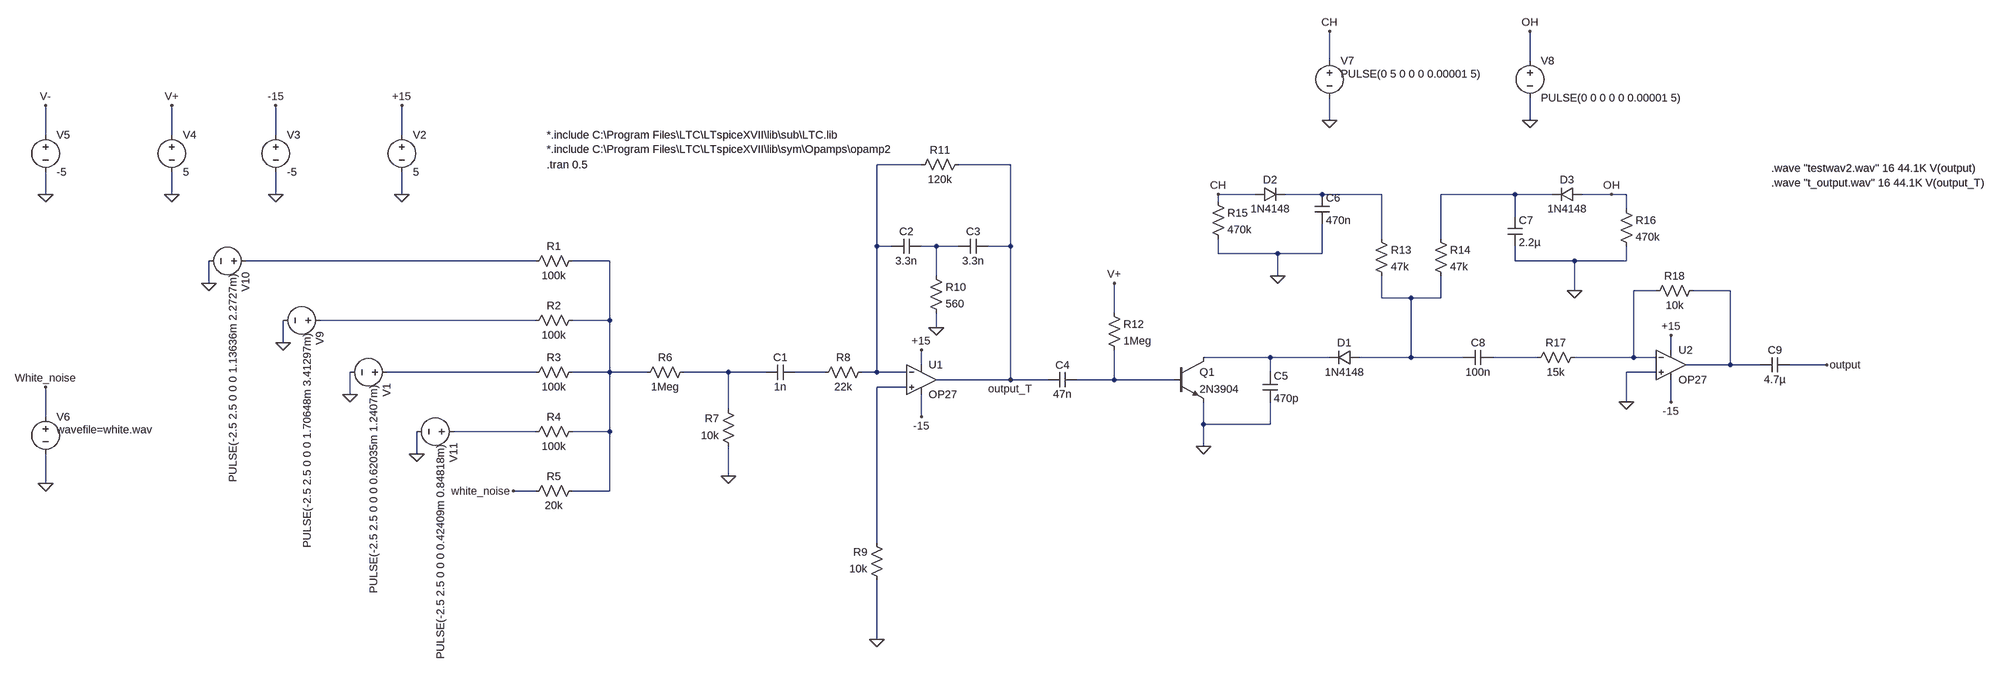
[diagram p0: schematic Cymbal - Mickey Delp.asc]
Cymbal - Mickey Delp.asc, the LTspice schematic file:
Version 4
SHEET 1 3932 968
WIRE 1760 -320 1760 -384
WIRE 2192 -320 2192 -384
WIRE 1760 -192 1760 -240
WIRE 2192 -192 2192 -240
WIRE -1008 -160 -1008 -224
WIRE -736 -160 -736 -224
WIRE -512 -160 -512 -224
WIRE -240 -160 -240 -224
WIRE 880 -96 784 -96
WIRE 1072 -96 960 -96
WIRE -1008 -32 -1008 -80
WIRE -736 -32 -736 -80
WIRE -512 -32 -512 -80
WIRE -240 -32 -240 -80
WIRE 1600 -32 1520 -32
WIRE 1744 -32 1664 -32
WIRE 1872 -32 1744 -32
WIRE 2160 -32 2000 -32
WIRE 2240 -32 2160 -32
WIRE 2368 -32 2304 -32
WIRE 2400 -32 2368 -32
WIRE 1520 -16 1520 -32
WIRE 2400 0 2400 -32
WIRE 2160 16 2160 -32
WIRE 1872 64 1872 -32
WIRE 2000 64 2000 -32
WIRE 784 80 784 -96
WIRE 816 80 784 80
WIRE 912 80 880 80
WIRE 960 80 912 80
WIRE 1072 80 1072 -96
WIRE 1072 80 1024 80
WIRE 1520 96 1520 64
WIRE 1648 96 1520 96
WIRE 1744 96 1744 32
WIRE 1744 96 1648 96
WIRE 48 112 -576 112
WIRE 208 112 128 112
WIRE 2160 112 2160 80
WIRE 2288 112 2160 112
WIRE 2400 112 2400 80
WIRE 2400 112 2288 112
WIRE 912 144 912 80
WIRE 1648 144 1648 96
WIRE -656 160 -656 112
WIRE 2288 176 2288 112
WIRE 2464 176 2416 176
WIRE 2624 176 2544 176
WIRE 1872 192 1872 144
WIRE 1936 192 1872 192
WIRE 2000 192 2000 144
WIRE 2000 192 1936 192
WIRE 1296 224 1296 160
WIRE 48 240 -416 240
WIRE 208 240 208 112
WIRE 208 240 128 240
WIRE 912 256 912 224
WIRE -496 288 -496 240
WIRE 2496 304 2496 272
WIRE 1632 320 1488 320
WIRE 1760 320 1632 320
WIRE 1936 320 1936 192
WIRE 1936 320 1824 320
WIRE 2048 320 1936 320
WIRE 2208 320 2112 320
WIRE 2416 320 2416 176
WIRE 2416 320 2288 320
WIRE 2464 320 2416 320
WIRE 880 336 880 304
WIRE 2624 336 2624 176
WIRE 2624 336 2528 336
WIRE 2688 336 2624 336
WIRE 2832 336 2752 336
WIRE 48 352 -272 352
WIRE 208 352 208 240
WIRE 208 352 128 352
WIRE 288 352 208 352
WIRE 464 352 368 352
WIRE 544 352 464 352
WIRE 672 352 608 352
WIRE 784 352 784 80
WIRE 784 352 752 352
WIRE 848 352 784 352
WIRE 1632 352 1632 320
WIRE 2464 352 2400 352
WIRE 1072 368 1072 80
WIRE 1072 368 912 368
WIRE 1152 368 1072 368
WIRE 1296 368 1296 304
WIRE 1296 368 1216 368
WIRE 1424 368 1296 368
WIRE 848 384 784 384
WIRE -352 400 -352 352
WIRE 2400 416 2400 352
WIRE 2496 416 2496 368
WIRE 464 432 464 352
WIRE -1008 448 -1008 384
WIRE 880 448 880 400
WIRE 1488 464 1488 416
WIRE 1632 464 1632 416
WIRE 1632 464 1488 464
WIRE 48 480 -128 480
WIRE 208 480 208 352
WIRE 208 480 128 480
WIRE 1488 512 1488 464
WIRE -208 528 -208 480
WIRE 464 576 464 512
WIRE -1008 592 -1008 528
WIRE 48 608 0 608
WIRE 208 608 208 480
WIRE 208 608 128 608
WIRE 784 720 784 384
WIRE 784 928 784 800
FLAG 464 576 0
FLAG 784 928 0
FLAG 912 256 0
FLAG 1296 160 V+
FLAG 1488 512 0
FLAG -352 400 0
FLAG -240 -32 0
FLAG -512 -32 0
FLAG -240 -224 +15
FLAG -512 -224 -15
FLAG 880 448 -15
FLAG 880 304 +15
FLAG 1648 144 0
FLAG 1520 -32 CH
FLAG 2368 -32 OH
FLAG 2288 176 0
FLAG -736 -32 0
FLAG -1008 -32 0
FLAG -736 -224 V+
FLAG -1008 -224 V-
FLAG -1008 592 0
FLAG -1008 384 White_noise
FLAG 2496 416 -15
FLAG 2496 272 +15
FLAG 2400 416 0
FLAG 1760 -192 0
FLAG 1760 -384 CH
FLAG 2832 336 output
FLAG 2192 -192 0
FLAG 2192 -384 OH
FLAG 1072 368 output_T
FLAG -496 288 0
FLAG -656 160 0
FLAG -208 528 0
FLAG 0 608 white_noise
SYMBOL res 144 96 R90
WINDOW 0 0 56 VBottom 2
WINDOW 3 32 56 VTop 2
SYMATTR InstName R1
SYMATTR Value 100k
SYMBOL res 144 224 R90
WINDOW 0 0 56 VBottom 2
WINDOW 3 32 56 VTop 2
SYMATTR InstName R2
SYMATTR Value 100k
SYMBOL res 144 336 R90
WINDOW 0 0 56 VBottom 2
WINDOW 3 32 56 VTop 2
SYMATTR InstName R3
SYMATTR Value 100k
SYMBOL res 144 464 R90
WINDOW 0 0 56 VBottom 2
WINDOW 3 32 56 VTop 2
SYMATTR InstName R4
SYMATTR Value 100k
SYMBOL res 144 592 R90
WINDOW 0 0 56 VBottom 2
WINDOW 3 32 56 VTop 2
SYMATTR InstName R5
SYMATTR Value 20k
SYMBOL res 384 336 R90
WINDOW 0 0 56 VBottom 2
WINDOW 3 32 56 VTop 2
SYMATTR InstName R6
SYMATTR Value 1Meg
SYMBOL res 480 528 R180
WINDOW 0 36 76 Left 2
WINDOW 3 36 40 Left 2
SYMATTR InstName R7
SYMATTR Value 10k
SYMBOL cap 608 336 R90
WINDOW 0 0 32 VBottom 2
WINDOW 3 32 32 VTop 2
SYMATTR InstName C1
SYMATTR Value 1n
SYMBOL res 768 336 R90
WINDOW 0 0 56 VBottom 2
WINDOW 3 32 56 VTop 2
SYMATTR InstName R8
SYMATTR Value 22k
SYMBOL res 800 816 R180
WINDOW 0 36 76 Left 2
WINDOW 3 36 40 Left 2
SYMATTR InstName R9
SYMATTR Value 10k
SYMBOL cap 880 64 R90
WINDOW 0 0 32 VBottom 2
WINDOW 3 32 32 VTop 2
SYMATTR InstName C2
SYMATTR Value 3.3n
SYMBOL cap 1024 64 R90
WINDOW 0 0 32 VBottom 2
WINDOW 3 32 32 VTop 2
SYMATTR InstName C3
SYMATTR Value 3.3n
SYMBOL res 896 128 R0
SYMATTR InstName R10
SYMATTR Value 560
SYMBOL res 976 -112 R90
WINDOW 0 0 56 VBottom 2
WINDOW 3 32 56 VTop 2
SYMATTR InstName R11
SYMATTR Value 120k
SYMBOL cap 1216 352 R90
WINDOW 0 0 32 VBottom 2
WINDOW 3 32 32 VTop 2
SYMATTR InstName C4
SYMATTR Value 47n
SYMBOL res 1280 208 R0
SYMATTR InstName R12
SYMATTR Value 1Meg
SYMBOL npn 1424 320 R0
SYMATTR InstName Q1
SYMATTR Value 2N3904
SYMBOL cap 1616 352 R0
SYMATTR InstName C5
SYMATTR Value 470p
SYMBOL voltage -256 352 R90
WINDOW 123 0 0 Left 2
WINDOW 39 0 0 Left 2
WINDOW 3 24 44 Left 2
SYMATTR Value PULSE(-2.5 2.5 0 0 0 0.62035m 1.2407m)
SYMATTR InstName V1
SYMBOL voltage -240 -176 R0
WINDOW 123 0 0 Left 2
WINDOW 39 0 0 Left 2
SYMATTR InstName V2
SYMATTR Value 5
SYMBOL voltage -512 -176 R0
WINDOW 123 0 0 Left 2
WINDOW 39 0 0 Left 2
SYMATTR InstName V3
SYMATTR Value -5
SYMBOL Opamps\\OP27 880 304 R0
SYMATTR InstName U1
SYMBOL diode 1824 304 R90
WINDOW 0 0 32 VBottom 2
WINDOW 3 32 32 VTop 2
SYMATTR InstName D1
SYMATTR Value 1N4148
SYMBOL res 1856 48 R0
SYMATTR InstName R13
SYMATTR Value 47k
SYMBOL res 1984 48 R0
SYMATTR InstName R14
SYMATTR Value 47k
SYMBOL cap 1728 -32 R0
SYMATTR InstName C6
SYMATTR Value 470n
SYMBOL diode 1600 -16 R270
WINDOW 0 32 32 VTop 2
WINDOW 3 0 32 VBottom 2
SYMATTR InstName D2
SYMATTR Value 1N4148
SYMBOL res 1504 -32 R0
SYMATTR InstName R15
SYMATTR Value 470k
SYMBOL cap 2144 16 R0
SYMATTR InstName C7
SYMATTR Value 2.2µ
SYMBOL diode 2304 -48 R90
WINDOW 0 0 32 VBottom 2
WINDOW 3 32 32 VTop 2
SYMATTR InstName D3
SYMATTR Value 1N4148
SYMBOL res 2384 -16 R0
SYMATTR InstName R16
SYMATTR Value 470k
SYMBOL cap 2112 304 R90
WINDOW 0 0 32 VBottom 2
WINDOW 3 32 32 VTop 2
SYMATTR InstName C8
SYMATTR Value 100n
SYMBOL voltage -736 -176 R0
WINDOW 123 0 0 Left 2
WINDOW 39 0 0 Left 2
SYMATTR InstName V4
SYMATTR Value 5
SYMBOL voltage -1008 -176 R0
WINDOW 123 0 0 Left 2
WINDOW 39 0 0 Left 2
SYMATTR InstName V5
SYMATTR Value -5
SYMBOL voltage -1008 432 R0
WINDOW 3 24 44 Left 2
SYMATTR Value wavefile=white.wav
SYMATTR InstName V6
SYMBOL res 2304 304 R90
WINDOW 0 0 56 VBottom 2
WINDOW 3 32 56 VTop 2
SYMATTR InstName R17
SYMATTR Value 15k
SYMBOL Opamps\\OP27 2496 272 R0
SYMATTR InstName U2
SYMBOL res 2560 160 R90
WINDOW 0 0 56 VBottom 2
WINDOW 3 32 56 VTop 2
SYMATTR InstName R18
SYMATTR Value 10k
SYMBOL cap 2752 320 R90
WINDOW 0 0 32 VBottom 2
WINDOW 3 32 32 VTop 2
SYMATTR InstName C9
SYMATTR Value 4.7µ
SYMBOL voltage 1760 -336 R0
WINDOW 123 0 0 Left 2
WINDOW 39 0 0 Left 2
WINDOW 3 24 44 Left 2
SYMATTR InstName V7
SYMATTR Value PULSE(0 5 0 0 0 0.00001 5)
SYMBOL voltage 2192 -336 R0
WINDOW 123 0 0 Left 2
WINDOW 39 0 0 Left 2
SYMATTR InstName V8
SYMATTR Value PULSE(0 0 0 0 0 0.00001 5)
SYMBOL voltage -400 240 R90
WINDOW 123 0 0 Left 2
WINDOW 39 0 0 Left 2
WINDOW 3 24 44 Left 2
SYMATTR Value PULSE(-2.5 2.5 0 0 0 1.70648m 3.41297m)
SYMATTR InstName V9
SYMBOL voltage -560 112 R90
WINDOW 123 0 0 Left 2
WINDOW 39 0 0 Left 2
WINDOW 3 24 44 Left 2
SYMATTR Value PULSE(-2.5 2.5 0 0 0 1.13636m 2.2727m)
SYMATTR InstName V10
SYMBOL voltage -112 480 R90
WINDOW 123 0 0 Left 2
WINDOW 39 0 0 Left 2
WINDOW 3 24 44 Left 2
SYMATTR Value PULSE(-2.5 2.5 0 0 0 0.42409m 0.84818m)
SYMATTR InstName V11
TEXT 72 -96 Left 2 !.tran 0.5
TEXT 72 -160 Left 2 !*.include C:\\Program Files\\LTC\\LTspiceXVII\\lib\\sub\\LTC.lib\n*.include C:\\Program Files\\LTC\\LTspiceXVII\\lib\\sym\\Opamps\\opamp2
TEXT 2712 -88 Left 2 !.wave "testwav2.wav" 16 44.1K V(output)\n.wave "t_output.wav" 16 44.1K V(output_T)

The netlist it stands for:
* Cymbal - Mickey Delp.asc
R1 N006 N005 100k
R2 N006 N010 100k
R3 N006 N013 100k
R4 N006 N018 100k
R5 N006 White_noise 20k
R6 N014 N006 1Meg
R7 0 N014 10k
C1 N015 N014 1n
R8 N001 N015 22k
R9 0 N017 10k
C2 N004 N001 3.3n
C3 output_T N004 3.3n
R10 N004 0 560
R11 output_T N001 120k
C4 N016 output_T 47n
R12 V+ N016 1Meg
Q1 N011 N016 0 0 2N3904
C5 N011 0 470p
V1 N013 0 PULSE(-2.5 2.5 0 0 0 0.62035m 1.2407m)
V2 +15 0 5
V3 -15 0 -5
XU1 N017 N001 +15 -15 output_T OP27  ; pins In+ In- V+ V- OUT
D1 N009 N011 1N4148
R13 N002 N009 47k
R14 N003 N009 47k
C6 N002 0 470n
D2 CH N002 1N4148
R15 CH 0 470k
C7 N003 0 2.2µ
D3 OH N003 1N4148
R16 OH 0 470k
C8 N012 N009 100n
V4 V+ 0 5
V5 V- 0 -5
V6 White_noise 0 wavefile=white.wav
R17 N007 N012 15k
XU2 0 N007 +15 -15 N008 OP27  ; pins In+ In- V+ V- OUT
R18 N008 N007 10k
C9 output N008 4.7µ
V7 CH 0 PULSE(0 5 0 0 0 0.00001 5)
V8 OH 0 PULSE(0 0 0 0 0 0.00001 5)
V9 N010 0 PULSE(-2.5 2.5 0 0 0 1.70648m 3.41297m)
V10 N005 0 PULSE(-2.5 2.5 0 0 0 1.13636m 2.2727m)
V11 N018 0 PULSE(-2.5 2.5 0 0 0 0.42409m 0.84818m)
.model D D
.lib standard.dio
.model NPN NPN
.model PNP PNP
.lib standard.bjt
.tran 0.5
*.include C:\Program Files\LTC\LTspiceXVII\lib\sub\LTC.lib
*.include C:\Program Files\LTC\LTspiceXVII\lib\sym\Opamps\opamp2
.wave "testwav2.wav" 16 44.1K V(output)
.wave "t_output.wav" 16 44.1K V(output_T)
.lib ADI.lib
.backanno
.end